# Altium project Modulo Principal.PrjPcb
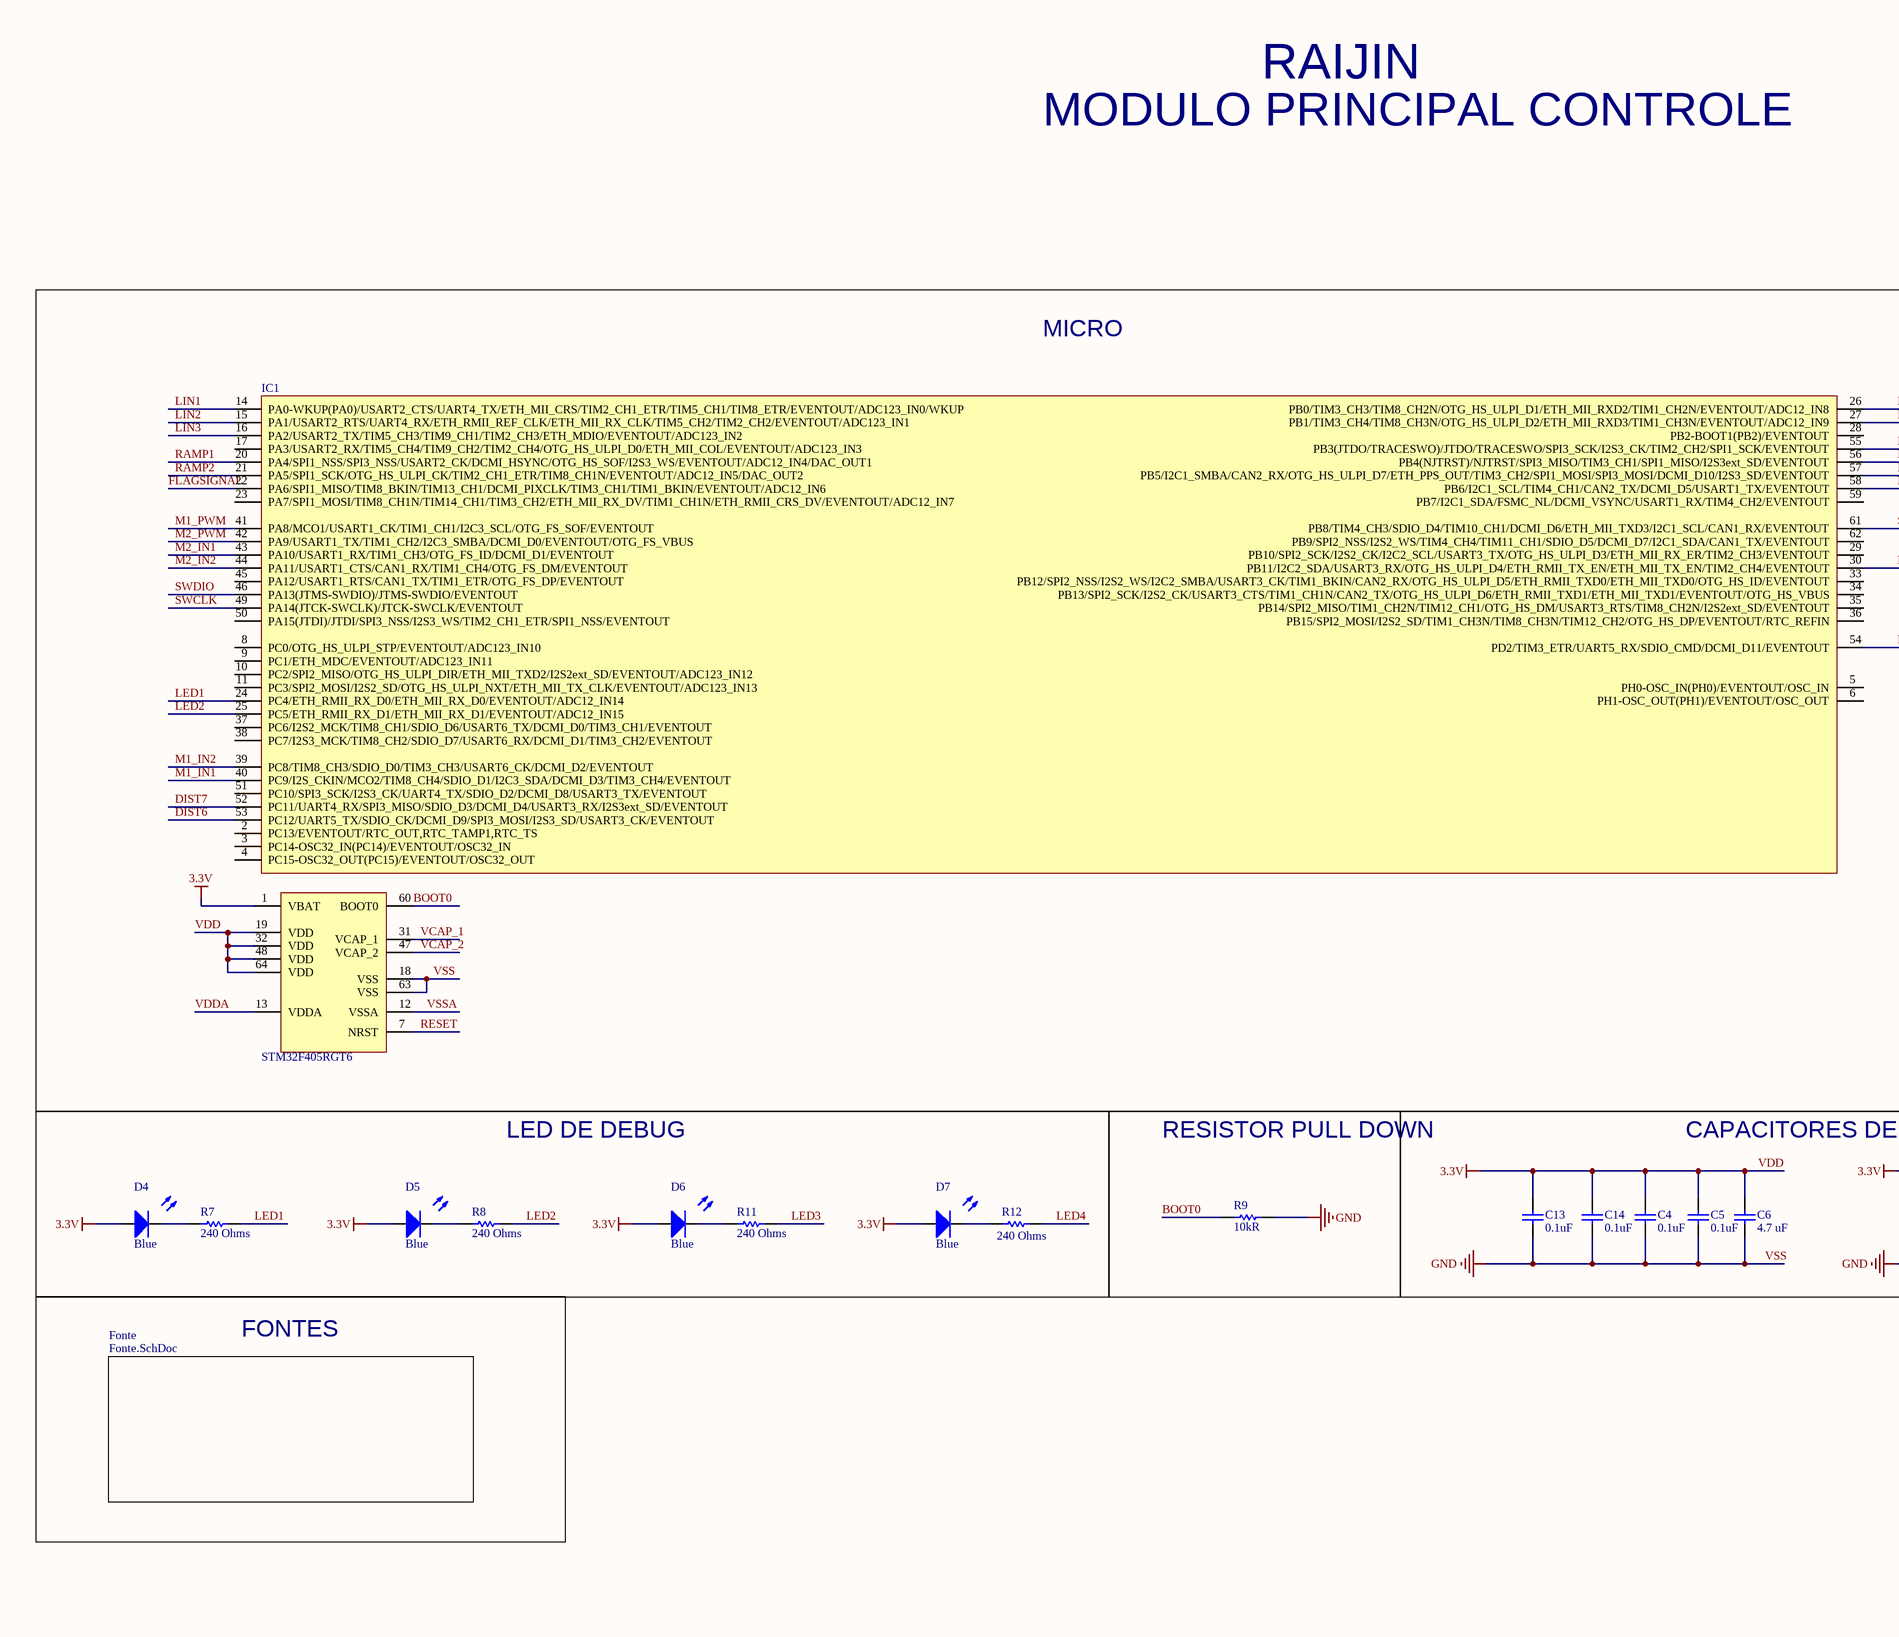
[diagram p0: Controle.SchDoc, left]
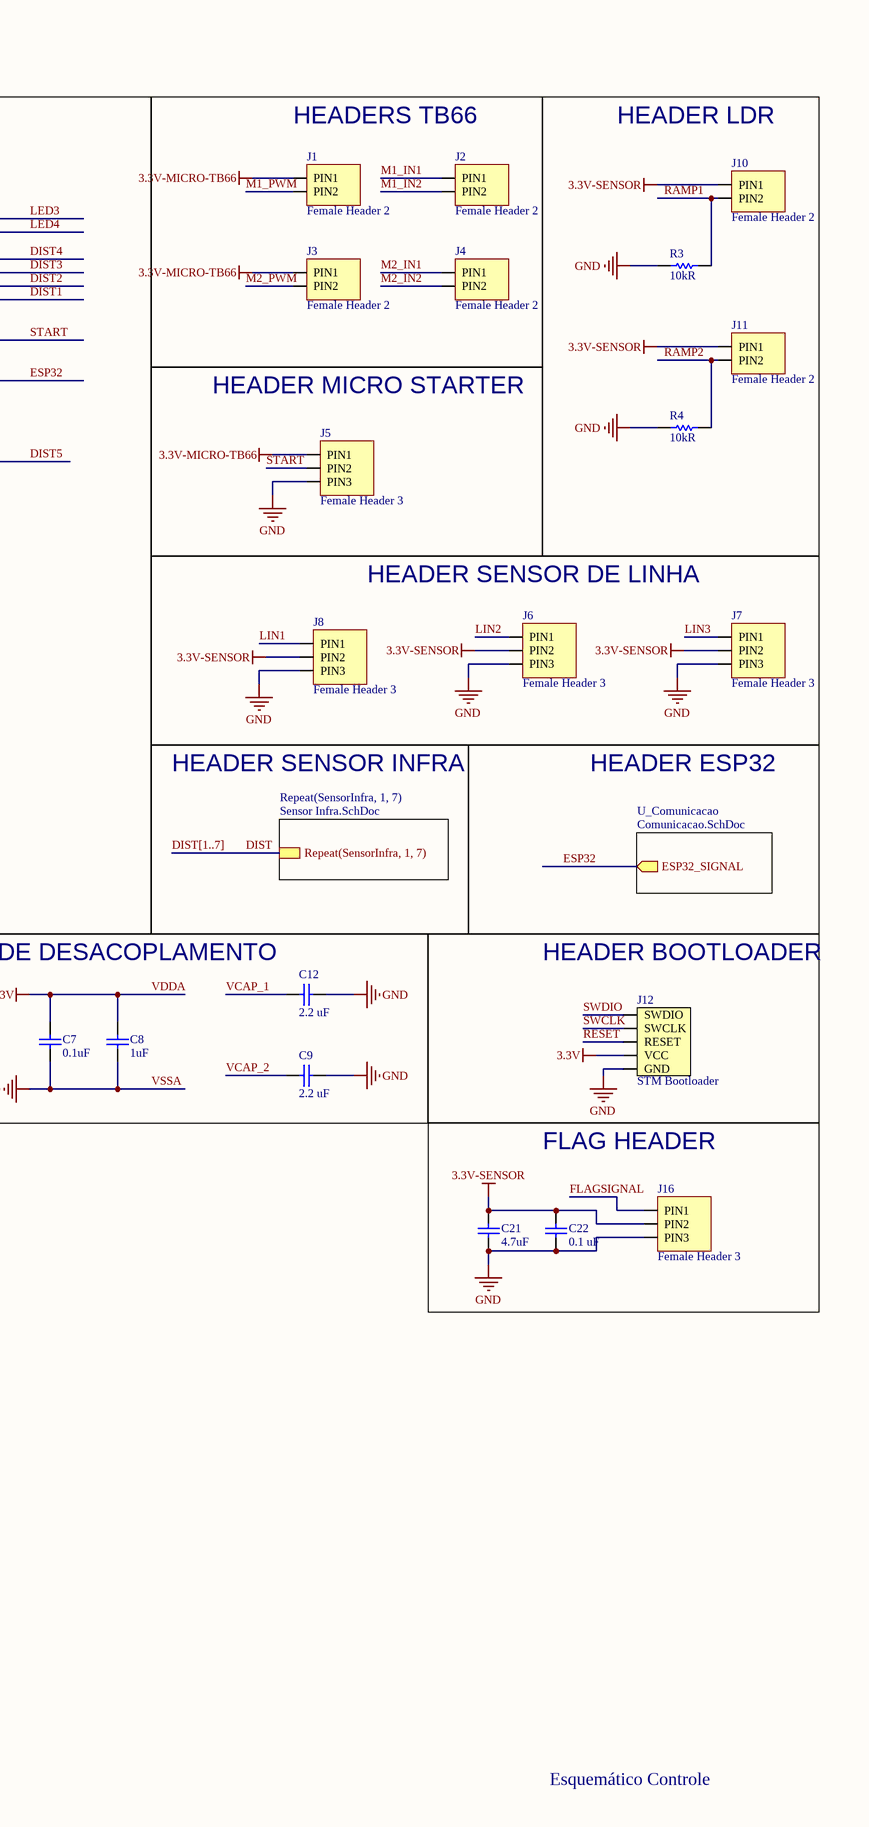
[diagram p1: Controle.SchDoc, right]
4 sheets, 93 parts. Net scope: hierarchical (ports join the sheet entries above them; power ports are global).
Board file: modulo_principal_footprint.PcbDoc
Sheets:
  Controle.SchDoc
    SensorInfra1 = Sensor Infra.SchDoc
    SensorInfra2 = Sensor Infra.SchDoc
    SensorInfra3 = Sensor Infra.SchDoc
    SensorInfra4 = Sensor Infra.SchDoc
    SensorInfra5 = Sensor Infra.SchDoc
    SensorInfra6 = Sensor Infra.SchDoc
    SensorInfra7 = Sensor Infra.SchDoc
    U_Comunicacao = Comunicacao.SchDoc
    Fonte = Fonte.SchDoc

## Sheet Controle.SchDoc
size A2; SheetNumber: 1; SheetTotal: 4

### Parts
C4  0.1uF  [CAPC1005X55N]
C5  0.1uF  [CAPC1005X55N]
C6  4.7 uF  [C0603]
C7  0.1uF  [CAPC1005X55N]
C8  1uF  [C0805]
C9  2.2 uF  [C0402]
C12  2.2 uF  [C0402]
C13  0.1uF  [CAPC1005X55N]
C14  0.1uF  [CAPC1005X55N]
C21  4.7uF  [C0603]
C22  0.1 uF  [C0603]
D4  Blue  [DIODO_2-SMD-3215]
D5  Blue  [DIODO_2-SMD-3215]
D6  Blue  [DIODO_2-SMD-3215]
D7  Blue  [DIODO_2-SMD-3215]
IC1  STM32F405RGT6  [LQFP-64]
J1  Female Header 2  [Female Header 2]
J2  Female Header 2  [Female Header 2]
J3  Female Header 2  [Female Header 2]
J4  Female Header 2  [Female Header 2]
J5  Female Header 3  [FEMALE HEADER 3]
J6  Female Header 3  [FEMALE HEADER 3]
J7  Female Header 3  [FEMALE HEADER 3]
J8  Female Header 3  [FEMALE HEADER 3]
J10  Female Header 2  [Female Header 2]
J11  Female Header 2  [Female Header 2]
J12  STM Bootloader  [STM BOOTLOADER]
J16  Female Header 3  [FEMALE HEADER 3]
R3  10kR  [RESISTOR_0402]
R4  10kR  [RESISTOR_0402]
R7  240 Ohms  [RESC1608X55N]
R8  240 Ohms  [RESC1608X55N]
R9  10kR  [RESISTOR_0402]
R11  240 Ohms  [RESC1608X55N]
R12  240 Ohms  [RESC1608X55N]

### Blocks framed on the sheet
MICRO: IC1
HEADERS TB66: J1-J4
HEADER LDR: J10 J11 R3 R4
HEADER MICRO STARTER: J5
HEADER SENSOR DE LINHA: J6-J8
LED DE DEBUG: D4-D7 R7 R8 R11 R12
RESISTOR PULL DOWN: R9
CAPACITORES DE DESACOPLAMENTO: C4-C9 C12-C14
HEADER BOOTLOADER: J12
FLAG HEADER: C21 C22 J16

### Sub-sheets
Fonte = Fonte.SchDoc: no entries
Repeat(SensorInfra, 1, 7) = Sensor Infra.SchDoc: Repeat(SensorInfra, 1, 7)
U_Comunicacao = Comunicacao.SchDoc: ESP32_SIGNAL (out)

### Nets
3.3V-MICRO-TB66: J1.PIN1 J3.PIN1 J5.PIN1
3.3V-SENSOR: C21.2 C22.2 J6.PIN2 J7.PIN2 J8.PIN2 J10.PIN1 J11.PIN1 J16.PIN2
VDD: C4.2 C5.2 C6.2 C7.2 C8.2 C13.2 C14.2 D4.A D5.A D6.A D7.A IC1.1(VBAT) IC1.13(VDDA) IC1.19(VDD) IC1.32(VDD) IC1.48(VDD) IC1.64(VDD) J12.VCC  [also labelled 3.3V, VDDA]
VSS: C4.1 C5.1 C6.1 C7.1 C8.1 C9.1 C12.1 C13.1 C14.1 C21.1 C22.1 IC1.12(VSSA) IC1.18(VSS) IC1.63(VSS) J5.PIN3 J6.PIN3 J7.PIN3 J8.PIN3 J12.GND J16.PIN3 R3.1 R4.1 R9.2  [also labelled GND, VSSA]
BOOT0: IC1.60(BOOT0) R9.1
DIST: sheet Repeat(SensorInfra, 1, 7)/Repeat(SensorInfra, 1, 7)
DIST1: IC1.58(PB6/I2C1_SCL/TIM4_CH1/CAN2_TX/DCMI_D5/USART1_TX/EVENTOUT)
DIST2: IC1.57(PB5/I2C1_SMBA/CAN2_RX/OTG_HS_ULPI_D7/ETH_PPS_OUT/TIM3_CH2/SPI1_MOSI/SPI3_MOSI/DCMI_D10/I2S3_SD/EVENTOUT)
DIST3: IC1.56(PB4(NJTRST)/NJTRST/SPI3_MISO/TIM3_CH1/SPI1_MISO/I2S3ext_SD/EVENTOUT)
DIST4: IC1.55(PB3(JTDO/TRACESWO)/JTDO/TRACESWO/SPI3_SCK/I2S3_CK/TIM2_CH2/SPI1_SCK/EVENTOUT)
DIST5: IC1.54(PD2/TIM3_ETR/UART5_RX/SDIO_CMD/DCMI_D11/EVENTOUT)
DIST6: IC1.53(PC12/UART5_TX/SDIO_CK/DCMI_D9/SPI3_MOSI/I2S3_SD/USART3_CK/EVENTOUT)
DIST7: IC1.52(PC11/UART4_RX/SPI3_MISO/SDIO_D3/DCMI_D4/USART3_RX/I2S3ext_SD/EVENTOUT)
ESP32: IC1.30(PB11/I2C2_SDA/USART3_RX/OTG_HS_ULPI_D4/ETH_RMII_TX_EN/ETH_MII_TX_EN/TIM2_CH4/EVENTOUT) ; sheet U_Comunicacao/ESP32_SIGNAL
FLAGSIGNAL: IC1.22(PA6/SPI1_MISO/TIM8_BKIN/TIM13_CH1/DCMI_PIXCLK/TIM3_CH1/TIM1_BKIN/EVENTOUT/ADC12_IN6) J16.PIN1
LED1: IC1.24(PC4/ETH_RMII_RX_D0/ETH_MII_RX_D0/EVENTOUT/ADC12_IN14) R7.2
LED2: IC1.25(PC5/ETH_RMII_RX_D1/ETH_MII_RX_D1/EVENTOUT/ADC12_IN15) R8.2
LED3: IC1.26(PB0/TIM3_CH3/TIM8_CH2N/OTG_HS_ULPI_D1/ETH_MII_RXD2/TIM1_CH2N/EVENTOUT/ADC12_IN8) R11.2
LED4: IC1.27(PB1/TIM3_CH4/TIM8_CH3N/OTG_HS_ULPI_D2/ETH_MII_RXD3/TIM1_CH3N/EVENTOUT/ADC12_IN9) R12.2
LIN1: IC1.14(PA0-WKUP(PA0)/USART2_CTS/UART4_TX/ETH_MII_CRS/TIM2_CH1_ETR/TIM5_CH1/TIM8_ETR/EVENTOUT/ADC123_IN0/WKUP) J8.PIN1
LIN2: IC1.15(PA1/USART2_RTS/UART4_RX/ETH_RMII_REF_CLK/ETH_MII_RX_CLK/TIM5_CH2/TIM2_CH2/EVENTOUT/ADC123_IN1) J6.PIN1
LIN3: IC1.16(PA2/USART2_TX/TIM5_CH3/TIM9_CH1/TIM2_CH3/ETH_MDIO/EVENTOUT/ADC123_IN2) J7.PIN1
M1_IN1: IC1.40(PC9/I2S_CKIN/MCO2/TIM8_CH4/SDIO_D1/I2C3_SDA/DCMI_D3/TIM3_CH4/EVENTOUT) J2.PIN1
M1_IN2: IC1.39(PC8/TIM8_CH3/SDIO_D0/TIM3_CH3/USART6_CK/DCMI_D2/EVENTOUT) J2.PIN2
M1_PWM: IC1.41(PA8/MCO1/USART1_CK/TIM1_CH1/I2C3_SCL/OTG_FS_SOF/EVENTOUT) J1.PIN2
M2_IN1: IC1.43(PA10/USART1_RX/TIM1_CH3/OTG_FS_ID/DCMI_D1/EVENTOUT) J4.PIN1
M2_IN2: IC1.44(PA11/USART1_CTS/CAN1_RX/TIM1_CH4/OTG_FS_DM/EVENTOUT) J4.PIN2
M2_PWM: IC1.42(PA9/USART1_TX/TIM1_CH2/I2C3_SMBA/DCMI_D0/EVENTOUT/OTG_FS_VBUS) J3.PIN2
RAMP1: IC1.20(PA4/SPI1_NSS/SPI3_NSS/USART2_CK/DCMI_HSYNC/OTG_HS_SOF/I2S3_WS/EVENTOUT/ADC12_IN4/DAC_OUT1) J10.PIN2 R3.2
RAMP2: IC1.21(PA5/SPI1_SCK/OTG_HS_ULPI_CK/TIM2_CH1_ETR/TIM8_CH1N/EVENTOUT/ADC12_IN5/DAC_OUT2) J11.PIN2 R4.2
RESET: IC1.7(NRST) J12.RESET
START: IC1.61(PB8/TIM4_CH3/SDIO_D4/TIM10_CH1/DCMI_D6/ETH_MII_TXD3/I2C1_SCL/CAN1_RX/EVENTOUT) J5.PIN2
SWCLK: IC1.49(PA14(JTCK-SWCLK)/JTCK-SWCLK/EVENTOUT) J12.CLK(SWCLK)
SWDIO: IC1.46(PA13(JTMS-SWDIO)/JTMS-SWDIO/EVENTOUT) J12.DIO(SWDIO)
VCAP_1: C12.2 IC1.31(VCAP_1)
VCAP_2: C9.2 IC1.47(VCAP_2)
NetD4_C: D4.C R7.1
NetD5_C: D5.C R8.1
NetD6_C: D6.C R11.1
NetD7_C: D7.C R12.1

Not connected (* = marked no-connect by the designer): IC1 2(PC13/EVENTOUT/RTC_OUT,RTC_TAMP1,RTC_TS) 3(PC14-OSC32_IN(PC14)/EVENTOUT/OSC32_IN) 4(PC15-OSC32_OUT(PC15)/EVENTOUT/OSC32_OUT) 5(PH0-OSC_IN(PH0)/EVENTOUT/OSC_IN) 6(PH1-OSC_OUT(PH1)/EVENTOUT/OSC_OUT) 8(PC0/OTG_HS_ULPI_STP/EVENTOUT/ADC123_IN10) 9(PC1/ETH_MDC/EVENTOUT/ADC123_IN11) 10(PC2/SPI2_MISO/OTG_HS_ULPI_DIR/ETH_MII_TXD2/I2S2ext_SD/EVENTOUT/ADC123_IN12) 11(PC3/SPI2_MOSI/I2S2_SD/OTG_HS_ULPI_NXT/ETH_MII_TX_CLK/EVENTOUT/ADC123_IN13) 17(PA3/USART2_RX/TIM5_CH4/TIM9_CH2/TIM2_CH4/OTG_HS_ULPI_D0/ETH_MII_COL/EVENTOUT/ADC123_IN3) 23(PA7/SPI1_MOSI/TIM8_CH1N/TIM14_CH1/TIM3_CH2/ETH_MII_RX_DV/TIM1_CH1N/ETH_RMII_CRS_DV/EVENTOUT/ADC12_IN7) 28(PB2-BOOT1(PB2)/EVENTOUT) 29(PB10/SPI2_SCK/I2S2_CK/I2C2_SCL/USART3_TX/OTG_HS_ULPI_D3/ETH_MII_RX_ER/TIM2_CH3/EVENTOUT) 33(PB12/SPI2_NSS/I2S2_WS/I2C2_SMBA/USART3_CK/TIM1_BKIN/CAN2_RX/OTG_HS_ULPI_D5/ETH_RMII_TXD0/ETH_MII_TXD0/OTG_HS_ID/EVENTOUT) 34(PB13/SPI2_SCK/I2S2_CK/USART3_CTS/TIM1_CH1N/CAN2_TX/OTG_HS_ULPI_D6/ETH_RMII_TXD1/ETH_MII_TXD1/EVENTOUT/OTG_HS_VBUS) 35(PB14/SPI2_MISO/TIM1_CH2N/TIM12_CH1/OTG_HS_DM/USART3_RTS/TIM8_CH2N/I2S2ext_SD/EVENTOUT) 36(PB15/SPI2_MOSI/I2S2_SD/TIM1_CH3N/TIM8_CH3N/TIM12_CH2/OTG_HS_DP/EVENTOUT/RTC_REFIN) 37(PC6/I2S2_MCK/TIM8_CH1/SDIO_D6/USART6_TX/DCMI_D0/TIM3_CH1/EVENTOUT) 38(PC7/I2S3_MCK/TIM8_CH2/SDIO_D7/USART6_RX/DCMI_D1/TIM3_CH2/EVENTOUT) 45(PA12/USART1_RTS/CAN1_TX/TIM1_ETR/OTG_FS_DP/EVENTOUT) 50(PA15(JTDI)/JTDI/SPI3_NSS/I2S3_WS/TIM2_CH1_ETR/SPI1_NSS/EVENTOUT) 51(PC10/SPI3_SCK/I2S3_CK/UART4_TX/SDIO_D2/DCMI_D8/USART3_TX/EVENTOUT) 59(PB7/I2C1_SDA/FSMC_NL/DCMI_VSYNC/USART1_RX/TIM4_CH2/EVENTOUT) 62(PB9/SPI2_NSS/I2S2_WS/TIM4_CH4/TIM11_CH1/SDIO_D5/DCMI_D7/I2C1_SDA/CAN1_TX/EVENTOUT)

### Buses and harness runs
bus DIST[1..7]

### Notes on the sheet
- RAIJIN
- MODULO PRINCIPAL CONTROLE
- HEADER SENSOR INFRA
- HEADER ESP32
- FONTES
- Esquemático Controle

### Library data of the parts
C4 C5 C7 C13 C14 = GRM155R61C104KA88D: CAP CER 0.1uF 16V X5R 0402; Manufacturer: Murata; Tolerance: 10%; Library Control - Checked Footprint: Yes; Library Control - Person that Checked Footprint: Guilherme; Supplier 1: Mouser; Part Number: GRM155R61C104KA88D; Category: Ceramic Capacitors; Price: 1 = 0,10, 10=0,024, 100=0,011 (USD); Supplier Part Number 1: 81-GRM155R61C104KA8D; Library Ref: Capacitor; Operating Temperature: -55°C ~ 85°C; Package / Case: 0402 (1005 Metric); Size / Dimension: 1,0 L x 0,5 W x 0,5 H; Value: 0.1uF; Voltage - Rated: 16V; ESR: -; Dieletric: X5R; Library Control - Checked Schematic: Yes; Library Control - Last Update: 24/07/2021 11:05; Library Control - Person that Checked Schematic: Guilherme; Library Control - Person that did the Last Update Footprint: Guilherme; Library Control - Person that did the Last Update Schematic: Guilherme; ComponentLink1Description: Datasheet; ComponentLink1URL: https://br.mouser.com/datasheet/2/281/1/GRM155R61C104KA88_01A-1983743.pdf; ComponentLink2Description: Mouser Link; ComponentLink2URL: https://br.mouser.com/ProductDetail/Murata-Electronics/GRM155R61C104KA88D?qs=%2Fha2pyFadugsr51Fgcs3VGJIvx6dQb2fpcJyrxDKYTBEoW5q5paGTQ%3D%3D
C6 = GRM188R61C475KAAJD: CAP CER 4.7uF 16V X5R 0603; Manufacturer: MURATA ELECTRONICS; Tolerance: 10%; Voltage - Rated: 16 VDC; ESR: 100mΩ; Library Control - Checked Schematic: Guilherme; Library Control - Person that did the Last Update Footprint: Raquel; Library Control - Person that did the Last Update Schematic: Marcos; Supplier 1: Mouser; Part Number: GRM188R61C475KAAJD; Category: Ceramic capacitor; Price: 1=0,39, 10=0,27, 100=0,172, 1000=0,153 (USD); Supplier Part Number 1: 81-GRM188R61C475KAJD; Library Ref: Capacitor; Operating Temperature: -55°C ~ 85ºC; Package / Case: 0603(1608 metric); Size / Dimension: 1.6 mm L x 0.8 mm W x 0.8 mm H; Value: 4.7 uF; Dieletric: X5R; Library Control - Last Update: 27/06/2021 16:02; Library Control - Person that Checked Schematic: Guilherme; ComponentLink1Description: Datasheet; ComponentLink1URL: https://br.mouser.com/datasheet/2/281/murata_03052018_GRM_Series_1-1310166.pdf; ComponentLink2Description: Mouser Link; ComponentLink2URL: https://br.mouser.com/ProductDetail/Murata-Electronics/GRM188R61C475KAAJD?qs=mJtAphxf33T5qOjL9fHG9Q%3D%3D
C8 = CC0805ZRY5V8BB105: CAP CER 1uF 25V Y5V 0805; Manufacturer: Yageo; Tolerance: -20%, +80%; ESR: 0.05; Library Control - Checked Footprint: Yes; Library Control - Person that Checked Footprint: Nikaum; Supplier 1: Mouser; Part Number: CC0805ZRY5V8BB105; Category: Ceramic Capacitor; Price: 1=0.21, 10=0.151, 100=0.071 (USD); Supplier Part Number 1: 603-CC805KRX7R9BB331; Library Ref: Capacitor; Operating Temperature: -30 C ~ 85 C; Package / Case: 0805 (2012 Metric); Size / Dimension: 2,00 L x 1,25 W x 0,85 H; Value: 1uF; Voltage - Rated: 25V; Dieletric: Y5V; Library Control - Checked Schematic: Yes; Library Control - Last Update: 27/06/2021 23:54; Library Control - Person that Checked Schematic: Nikaum; Library Control - Person that did the Last Update Footprint: NIkaum; Library Control - Person that did the Last Update Schematic: Nikaum; ComponentLink1Description: Datasheet; ComponentLink1URL: https://br.mouser.com/datasheet/2/447/yago_s_a0004841839_1-2286631.pdf; ComponentLink2Description: Mouser Link; ComponentLink2URL: https://br.mouser.com/ProductDetail/Yageo/CC0805ZRY5V8BB105?qs=%2Fha2pyFaduhNpscxq1sti%2FWGfef5%252B7abNQFh0pSFqzoFpwPoZWE8UM%252BupYNGXIAb
C9 C12 = C1005X5R1C225M050BC: CAP CER 2.2UF 16V X5R 0402; Manufacturer: TDK; Tolerance: 20%; Voltage - Rated: 16 VDC; Library Control - Checked Footprint: Yes; Library Control - Person that Checked Footprint: Nikaum; Supplier 1: Mouser; Part Number: C1005X5R1C225M050BC; Category: Ceramic Capacitor; Price: 1= 0,35, 10= 0,24, 100= 0,137 (USD); Supplier Part Number 1: 810-C1005X5R1C225M; Library Ref: Capacitor; Operating Temperature: -55 C ~ 85 C; Package / Case: 0402 (1005 Metric); Size / Dimension: 1,00 L x 0,50 W x 0,50 H; Value: 2.2 uF; Dieletric: X5R; Library Control - Checked Schematic: Yes; Library Control - Last Update: 28/06/2021 00:25; Library Control - Person that Checked Schematic: Nikaum; Library Control - Person that did the Last Update Footprint: Nikaum; Library Control - Person that did the Last Update Schematic: Nikaum; ComponentLink1Description: Datasheet; ComponentLink1URL: https://product.tdk.com/system/files/dam/doc/product/capacitor/ceramic/mlcc/catalog/mlcc_commercial_general_en.pdf; ComponentLink2Description: Mouser Link; ComponentLink2URL: https://br.mouser.com/ProductDetail/TDK/C1005X5R1C225M050BC?qs=%2Fha2pyFaduhU5KeTuzJ6cgu5msb4qv%252BHR3wvbG6WdO9o%252B44FZFkWvfar1ahjHCOq; ComponentLink3Description: ESR; ComponentLink3URL: https://product.tdk.com/en/search/capacitor/ceramic/mlcc/info?part_no=C1005X5R1C225M050BC
C21 = CC0603KRX5R8BB475: CAP CER 4.7uF 25V X5R 0603; Manufacturer: Yageo; Tolerance: 10%; ESR: 0.05; Library Control - Checked Footprint: Yes; Library Control - Person that Checked Footprint: Nikaum; Supplier 1: Mouser; Part Number: CC0603KRX5R8BB475; Category: Ceramic Capacitor; Price: 1=0.25, 10=0.164, 100=0,093 (USD); Supplier Part Number 1: 603-CC0603KRX58BB475; Library Ref: Capacitor; Operating Temperature: -55 C ~ 125 C; Package / Case: 0603 (1608 Metric); Size / Dimension: 1,60 L x 0,80 W x 0,87 H; Value: 4.7uF; Voltage - Rated: 25V; Dieletric: X5R; Library Control - Checked Schematic: Yes; Library Control - Last Update: 27/06/2021 23:47; Library Control - Person that Checked Schematic: Nikaum; Library Control - Person that did the Last Update Footprint: Nikaum; Library Control - Person that did the Last Update Schematic: Nikaum; ComponentLink1Description: Datasheet; ComponentLink1URL: https://br.mouser.com/datasheet/2/447/yago_s_a0011397150_1-2286655.pdf; ComponentLink2Description: Mouser Link; ComponentLink2URL: https://br.mouser.com/ProductDetail/Yageo/CC0603KRX5R8BB475?qs=%2Fha2pyFaduh%2F7Q8z%252B7Ot0eflSx5gYDgPHryPFxzpgCUeMwc25ZtPlNgXae48%252BTjy
C22 = C0603C104M5RACTU: CAP CER 0.1uF 50V X7R 0603; Manufacturer: Kemet; Tolerance: 20%; Voltage - Rated: 50 VDC; Library Control - Checked Footprint: Yes; Library Control - Person that Checked Footprint: Stéfany (Ster); Supplier 1: Mouser; Part Number: C0603C104M5RACTU; Category: Ceramic Capacitor; Price: 1=0,22 10=0,154 100=0.106 (USD); Supplier Part Number 1: 80-C0603C104M5R; Library Ref: Capacitor; Operating Temperature: -55°C ~ 125°C; Package / Case: 0603(1608 metric); Size / Dimension: 1.6 L x 0.8 W x 0.8 H (USD); Value: 0.1 uF; Dieletric: X7R; Library Control - Checked Schematic: Yes; Library Control - Last Update: 09/09/2021 15:15; Library Control - Person that Checked Schematic: Stéfany (Ster); Library Control - Person that did the Last Update Schematic: Stéfany (Ster); ComponentLink1Description: Datasheet; ComponentLink1URL: https://br.mouser.com/datasheet/2/212/KEM_C1002_X7R_SMD-1102033.pdf; ComponentLink2Description: Mouser Link; ComponentLink2URL: https://br.mouser.com/ProductDetail/KEMET/C0603C104M5RACTU?qs=YkRtRX%252BfoqJT%252B0m410IP4A%3D%3D; ComponentLink3Description: ESR; ComponentLink3URL: https://www.kemet.com/en/us/capacitors/ceramic/product/C0603C104M5RACTU.html
D4-D7 = EAST3215BA5: LED 75mW BLUE 45MCD 3215; Manufacturer: Everlight Electronics; Current - Forward (If): 20 mA; Voltage - Forward (Vf): 3,30 V; Viewing Angle: 130°; Wavelength: 468 nm; Reverse Voltage: 5 V; Library Control - Checked Footprint: yes; Library Control - Person that Checked Footprint: Lucas; Library Control - Person that did the Last Update Footprint: Stéfany (Ster); Supplier 1: Mouser; Part Number: EAST3215BA5; Category: Standard LEDs - SMD; Price: 1 = 0,3800, 10 = 0,2050, 100 = 0.1080 (USD); Package / Case: 3215; Color: Blue; Operating Temperature: - 40 °C ~ 85 °C; Luminous Intensity: 45 mcd; Library Ref: Diodo/Led; Supplier Part Number 1: 638-EAST3215BA5; Max Power Dissipation: 75 mW; Max Current Rating: 20 mA; Library Control - Checked Schematic: yes; Library Control - Last Update: 13/06/2021 12:45; Library Control - Person that Checked Schematic: Lucas; Library Control - Person that did the Last Update Schematic: Stéfany (Ster); ComponentLink1Description: Mouser Link; ComponentLink1URL: https://www.mouser.com/ProductDetail/Everlight/EAST3215BA5?qs=Cqqh%252BS766wnzp9nQVj5A4g==; ComponentLink2Description: Datasheet; ComponentLink2URL: https://www.mouser.com/datasheet/2/143/EAST3215BA5-1154292.pdf
IC1 = STM32F405RGT6: IC MCU 32-BIT 192kB FLASH ARM Cortex-M4 168MHz  LQFP-64; Manufacturer: STM; Number of I/Os: 51; Oscillator Type: Internal; Program Memory Size: 1024kB; Peripherals: CAN, I2C, SDIO, I2S / SPI, UART / USART, USB; Core Processor: ARM Cortex M0+; Voltage - Supply (Vcc/Vdd): 1.8 V to 3.6 V; Number of Timers/Counters: 17; Number of ADC Channels: 16; Library Control - Person that did the Last Update Footprint: Marcos; Supplier 1: Mouser; Part Number: STM32F405RGT6; Category: ARM Microcontrollers - MCU; Price: 1 = 12,95, 10 = 11,91,  100 = 11,42, 500 = 8,95 (USD); Package/Case: LQFP-64; Operating Temperature: -40°C to 85°C; Connectivity: -; Speed: 168MHz; Program Memory Type: Flash; RAM Size: 192k B; Core Size: *; Number of SPI Channels: -; Number of I2C Channels: -; Number of UART/USART Channels: -; Number of Ethernet Channels: -; Series: STM32F405RG; Library Ref: Microcrontrollers; Supplier Part Number 1: 511-STM32F405RGT6; Library Control - Checked Footprint: *; Library Control - Checked Schematic: *; Library Control - Last Project that Used: *; Library Control - Last Update: *; Library Control - Person that Checked Footprint: *; Library Control - Person that Checked Schematic: *; Library Control - Person that did the Last Update Schematic: Marcos; ComponentLink1Description: Mouser Link; ComponentLink1URL: https://www.mouser.com/ProductDetail/STMicroelectronics/STM32G030J6M6?qs=uwxL4vQweFMe%2Fiu4dY6izA%3D%3D; ComponentLink2Description: Datasheet Link; ComponentLink2URL: https://www.mouser.com/datasheet/2/389/dm00613878-1799578.pdf
J1-J4 J10 J11 = Female Header 2: System: Connector
J5-J8 J16 = Female Header 3: Number of Contacts: 3; System: Connector; Library Ref: Header
J12 = Barramento de Gravação STM: BARRAMENTO DE GRAVAÇÃO; Number of Contacts: 5; Library Ref: Header
R3 R4 R9 = RC0402JR-0710KL: RES SMD 10K OHM 5% 1/16W 0402; Manufacturer: Yageo; Temperature Coefficient: 100 PPM / C; Power Rating: 62.5 mW (1/16 W); Voltage Rating: 50 V; Library Control - Checked Footprint: Yes; Library Control - Person that Checked Footprint: Nikaum; Library Control - Person that did the Last Update Footprint: Dalarme; Supplier 1: Mouser; Part Number: RC0402JR-0710KL; Category: Thick Film Resistors - SMD; Price: 1=0,10, 10=0,01, 100=0,004 1000=0,003 (USD); Package / Case: 0402 (1005 Metric); Operating Temperature: -55 C ~ 155 C; Value: 10kR; Tolerance: 5 %; Library Ref: Resistor; Resistor Type: Fixo; Size / Dimension: 1 mm L x  0.5 mm W x  0.35 mm H; Supplier Part Number 1: 603-RC0402JR-0710KL; Library Control - Checked Schematic: Yes; Library Control - Last Update: 27/06/2021 20:59; Library Control - Person that Checked Schematic: Nikaum; Library Control - Person that did the Last Update Schematic: Nikaum; ComponentLink1Description: Mouser Link; ComponentLink1URL: https://br.mouser.com/ProductDetail/Yageo/RC0402JR-0710KL?qs=%2Fha2pyFadugksLQP8sr8wSFqaMq1e9zbbX4dfYXawN%252BqoBT8jIbVcw%3D%3D; ComponentLink2Description: Datasheet Link; ComponentLink2URL: https://br.mouser.com/datasheet/2/447/PYu_RC_Group_51_RoHS_L_10-1664068.pdf
R7 R8 R11 R12 = RC0603FR-07240RL: RES SMD 240 OHM 1% 1/10W 0603; Manufacturer: YAGEO; Temperature Coefficient: 100 PPM / C; Power Rating: 1/10 W (100 mW); Supplier 1: Mouser; Part Number: RC0603FR-07240RL; Category: Current Sense Resistors - SMD; Price: 1= 0,10, 10= 0,024, 100= 0,01 (USD); Package / Case: 0603 (1608 metric); Operating Temperature: -55C ~ +155C; Value: 240 Ohms; Tolerance: 1%; Voltage Rating: -; Library Ref: Resistor; Resistor Type: Fixed; Size / Dimension: 1.6mm L x 0.8mm W x 0.45mm H; Supplier Part Number 1: 603-RC0603FR-07240RL; ComponentLink1Description: Mouser Link; ComponentLink1URL: https://br.mouser.com/ProductDetail/YAGEO/RC0603FR-07240RL?qs=%2Fha2pyFaduiUxY9aBc7vYsXmDGghjtsAaASQnplf3Fe6IIYOTbEeqCNZ6k5LKUyr; ComponentLink2Description: Datasheet; ComponentLink2URL: https://br.mouser.com/datasheet/2/447/Yageo_03_18_2021_PYu_RC_Group_51_RoHS_L_11-2199992.pdf

## Sheet Sensor Infra.SchDoc
size A4; SheetNumber: 3; SheetTotal: 4
Used 7 times, as channels SensorInfra1, SensorInfra2, SensorInfra3, SensorInfra4, SensorInfra5, SensorInfra6, SensorInfra7. Parts and nets are listed once, with the designators drawn on the sheet.
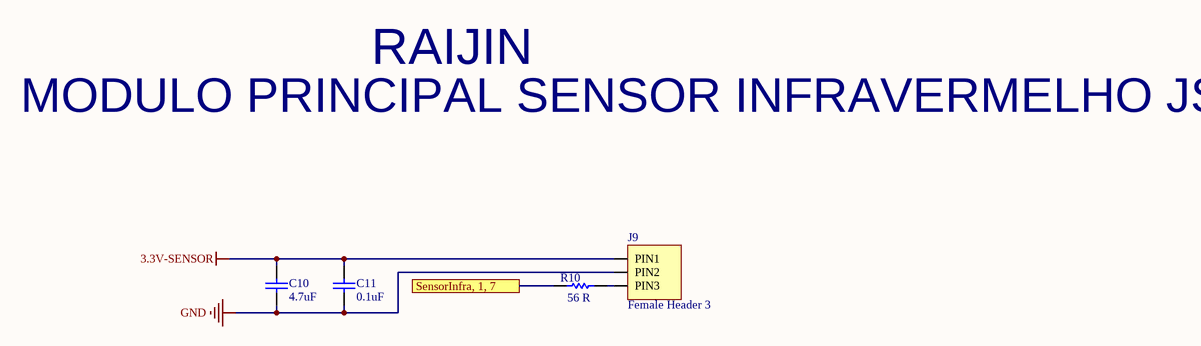
[diagram p2: Sensor Infra.SchDoc]

### Parts
C10  4.7uF  [C0805]
C11  0.1uF  [C0805]
J9  Female Header 3  [FEMALE HEADER 3]
R10  56 R  [RESISTOR_0603]

### Ports
SensorInfra, 1, 7

### Nets
3.3V-SENSOR: C10.2 C11.2 J9.PIN1
GND: C10.1 C11.1 J9.PIN2
SensorInfra, 1, 7: R10.1 ; port SensorInfra, 1, 7
NetJ9_PIN3: J9.PIN3 R10.2

### Channels
SensorInfra1: designators end in _SensorInfra1; ports SensorInfra, 1, 7=NetR10_SensorInfra1_1
SensorInfra2: designators end in _SensorInfra2; ports SensorInfra, 1, 7=NetR10_SensorInfra2_1
SensorInfra3: designators end in _SensorInfra3; ports SensorInfra, 1, 7=NetR10_SensorInfra3_1
SensorInfra4: designators end in _SensorInfra4; ports SensorInfra, 1, 7=NetR10_SensorInfra4_1
SensorInfra5: designators end in _SensorInfra5; ports SensorInfra, 1, 7=NetR10_SensorInfra5_1
SensorInfra6: designators end in _SensorInfra6; ports SensorInfra, 1, 7=NetR10_SensorInfra6_1
SensorInfra7: designators end in _SensorInfra7; ports SensorInfra, 1, 7=NetR10_SensorInfra7_1

### Notes on the sheet
- RAIJIN
- MODULO PRINCIPAL SENSOR INFRAVERMELHO JS40F

### Library data of the parts
C10 = 0805X475M250CT: CAP CER 4.7uF 25V 20% 0805; Manufacturer: Walsin; Dieletric: X5R; Library Control - Checked Footprint: No; Library Control - Checked Schematic: Yes; Library Control - Person that Checked Schematic: Guilherme; Library Control - Person that did the Last Update Schematic: Marcos; Supplier 1: Mouser; Part Number: 0805X475M250CT; Category: Ceramic Capacitor; Price: 1=0,26 10=0,178 100=0,101 1000=0,064 (USD); Supplier Part Number 1: 791-0805X475M250CT; Library Ref: Capacitor; Operating Temperature: -55°C ~ 85°C; Package / Case: 0805(2012 metric); Size / Dimension: 2 mm L x 1.25 mm W x 0.8 mm H; Tolerance: 20%; Value: 4.7uF; Voltage - Rated: 25V; ESR: -; Library Control - Last Update: 26/06/2021 19:59; ComponentLink1Description: Datasheet; ComponentLink1URL: https://br.mouser.com/datasheet/2/210/WTC_MLCC_General_Purpose-1534899.pdf; ComponentLink2Description: Mouser Link; ComponentLink2URL: https://br.mouser.com/ProductDetail/Walsin/0805X475M250CT?qs=%2Fha2pyFadugovbtJ4IPO2aI5%2FHfN6czWOLxzJ368rfolfgZFQZPK8JJR9MicoCMy
C11 = 08053C104KAT2A: CAP CER 0.1uF 25V X7R 0805; Manufacturer: AVX; Tolerance: 10%; ESR: 0.05; Library Control - Checked Footprint: Yes; Library Control - Person that Checked Footprint: Nikaum; Supplier 1: Mouser; Part Number: 08053C104KAT2A; Category: Ceramic Capacitor; Price: 1=0,14, 10=0,069, 100=0,038 (USD); Supplier Part Number 1: 581-08053C104K; Library Ref: Capacitor; Operating Temperature: -55 C ~ 125 C; Package / Case: 0805 (2012 metric); Size / Dimension: 2,00 L x 1,20 W x 0,50 H; Value: 0.1uF; Voltage - Rated: 25V; Dieletric: X7R; Library Control - Checked Schematic: Yes; Library Control - Last Update: 27/06/2021 23:35; Library Control - Person that Checked Schematic: Nikaum; Library Control - Person that did the Last Update Footprint: Nikaum; Library Control - Person that did the Last Update Schematic: Nikaum; ComponentLink1Description: Datasheet; ComponentLink1URL: https://br.mouser.com/datasheet/2/40/X7RDielectric-777024.pdf; ComponentLink2Description: Mouser Link; ComponentLink2URL: https://br.mouser.com/ProductDetail/AVX/08053C104KAT2A?qs=EihRZLdKnF2GcTBzDkE%2FiQ%3D%3D
J9 = Female Header 3: Number of Contacts: 3; System: Connector; Library Ref: Header
R10 = CR0603-FX-56R0ELF: RES SMD 56 OHMS 1% 1/10W 0603; Manufacturer: Bourns; Temperature Coefficient: 100 PPM / C; Power Rating: 100 mW (1/10 W); Voltage Rating: 50 V; Library Control - Checked Footprint: Yes; Library Control - Person that Checked Footprint: Nikaum; Library Control - Person that did the Last Update Footprint: Nicolas; Supplier 1: Mouser; Part Number: CR0603-FX-56R0ELF; Category: Thick Film Resistors - SMD; Price: 1=0,10, 10=0,019, 100=0,011(USD); Package / Case: 0603 (1608 Metric); Operating Temperature: - 55°C ~ 155°C; Value: 56 R; Tolerance: 1 %; Library Ref: Resistor; Resistor Type: Fixo; Size / Dimension: 1,60 L x 0,80 W x 0,45 H; Supplier Part Number 1: 652-CR0603FX-56R0ELF; Library Control - Checked Schematic: Yes; Library Control - Last Update: 27/06/2021 20:52; Library Control - Person that Checked Schematic: Nikaum; Library Control - Person that did the Last Update Schematic: Nikaum; ComponentLink1Description: Mouser Link; ComponentLink1URL: https://br.mouser.com/ProductDetail/Bourns/CR0603-FX-56R0ELF?qs=0nF2VnfAjXkVwSNglvrNkw%3D%3D; ComponentLink2Description: Datasheet; ComponentLink2URL: https://br.mouser.com/datasheet/2/54/crxxxxx-1858361.pdf

## Sheet Comunicacao.SchDoc
size A4; SheetNumber: 4; SheetTotal: 4
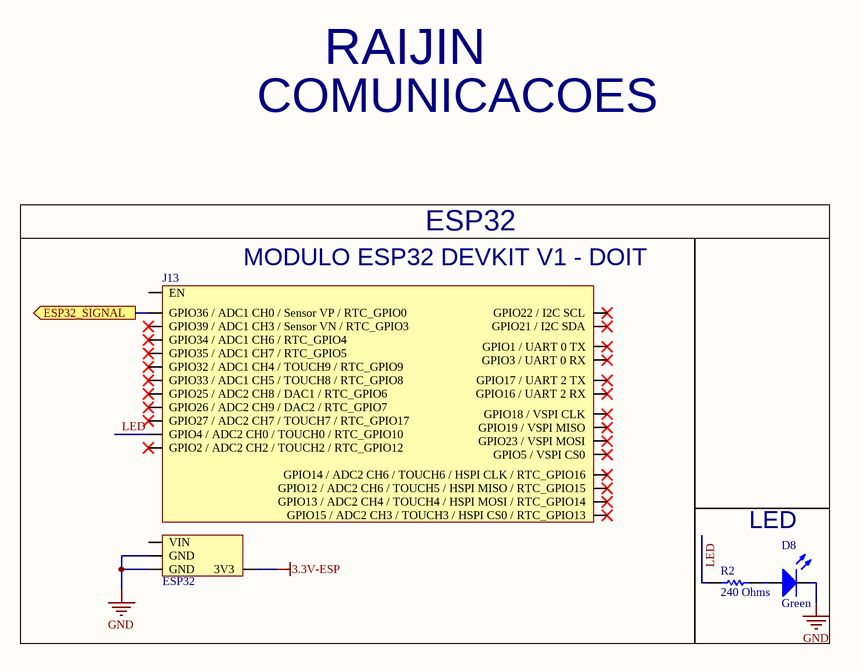
[diagram p3: Comunicacao.SchDoc]

### Parts
D8  Green  [LED_0603]
J13  ESP32  [Modulo ESP32]
R2  240 Ohms  [RESC1608X55N]

### Blocks framed on the sheet
ESP32: J13
LED: D8 R2

### Ports
ESP32_SIGNAL (out)

### Nets
3.3V-ESP: J13.3V3
GND: D8.C J13.GND  [project net VSS]
ESP32: J13.PIN2(GPIO36_/_ADC1_CH0_/_Sensor_VP_/_RTC_GPIO0) ; port ESP32_SIGNAL
LED: J13.PIN26(GPIO4_/_ADC2_CH0_/_TOUCH0_/_RTC_GPIO10) R2.1
NetD8_A: D8.A R2.2

Not connected (* = marked no-connect by the designer): J13 EN PIN3(GPIO39_/_ADC1_CH3_/_Sensor_VN_/_RTC_GPIO3)* PIN4(GPIO34_/_ADC1_CH6_/_RTC_GPIO4)* PIN5(GPIO35_/_ADC1_CH7_/_RTC_GPIO5)* PIN6(GPIO32_/_ADC1_CH4_/_TOUCH9_/_RTC_GPIO9)* PIN7(GPIO33_/_ADC1_CH5_/_TOUCH8_/_RTC_GPIO8)* PIN8(GPIO25_/_ADC2_CH8_/_DAC1_/_RTC_GPIO6)* PIN9(GPIO26_/_ADC2_CH9_/_DAC2_/_RTC_GPIO7)* PIN10(GPIO27_/_ADC2_CH7_/_TOUCH7_/_RTC_GPIO17)* PIN11(GPIO14_/_ADC2_CH6_/_TOUCH6_/_HSPI_CLK_/_RTC_GPIO16)* PIN12(GPIO12_/_ADC2_CH6_/_TOUCH5_/_HSPI_MISO_/_RTC_GPIO15)* PIN13(GPIO13_/_ADC2_CH4_/_TOUCH4_/_HSPI_MOSI_/_RTC_GPIO14)* PIN16(GPIO23_/_VSPI_MOSI)* PIN17(GPIO22_/_I2C_SCL)* PIN18(GPIO1_/_UART_0_TX)* PIN19(GPIO3_/_UART_0_RX)* PIN20(GPIO21_/_I2C_SDA)* PIN21(GPIO19_/_VSPI_MISO)* PIN22(GPIO18_/_VSPI_CLK)* PIN23(GPIO5_/_VSPI_CS0)* PIN24(GPIO17_/_UART_2_TX)* PIN25(GPIO16_/_UART_2_RX)* PIN27(GPIO2_/_ADC2_CH2_/_TOUCH2_/_RTC_GPIO12)* PIN28(GPIO15_/_ADC2_CH3_/_TOUCH3_/_HSPI_CS0_/_RTC_GPIO13)* VIN

### Notes on the sheet
- RAIJIN
- COMUNICACOES
- (near J13) MODULO ESP32 DEVKIT V1 - DOIT

### Library data of the parts
D8 = 150060VS75000: LED 0.072W GREEN 40MCD 0603; Manufacturer: Wurth Elektronik; Current - Forward (If): 20 mA; Voltage - Forward (Vf): 2 V; Viewing Angle: 140°; Wavelength: 570nm; Max Power Dissipation: 72mW; Max Current Rating: 100mA; Reverse Voltage:: 5V; Library Control - Last Project that Used: Diodo/Led; Library Control - Person that Checked Footprint: Nícolas; Library Control - Person that did the Last Update Footprint: Marcos; Supplier 1: Mouser; Manufacturer Part Number: 150060VS75000; Category: Standard LEDs - SMD; Price: 1 = 0.15, 50 = 0.138, 100 = 0.118 (USD); Package / Case: 0603; Color: Green; Operating Temperature: -40~85 °C; Luminous Intensity: 40 mcd; Library Ref: LED; Supplier Part Number 1: 710-150060VS75000; Library Control - Checked Footprint: 25/07/2021; Library Control - Checked Schematic: 25/07/2021; Library Control - Last Update: 06/08/2021; Library Control - Person that Checked Schematic: Nícolas; Library Control - Person that did the Last Update Schematic: Marcos; ComponentLink1Description: Mouser Link; ComponentLink1URL: https://br.mouser.com/ProductDetail/Wurth-Elektronik/150060VS75000?qs=%2Fha2pyFaduhuT%2FKGSijZP0vTyJZ9U993KfsBQSxqATYhY9jnc2c09tXoMoJ3wn4L; ComponentLink2Description: Datasheet Link; ComponentLink2URL: https://br.mouser.com/datasheet/2/445/150060VS75000-1714627.pdf
J13 = Modulo ESP32: Header Modulo ESP32; Number of Contacts: 15; Library Control - Checked Footprint: Nikaum; Library Ref: Header; Library Control - Checked Schematic: Nikaum; Library Control - Last Project that Used: *; Library Control - Last Update: *; Library Control - Person that Checked Footprint: *; Library Control - Person that Checked Schematic: *; Library Control - Person that did the Last Update Schematic: Nikaum; Library Control - Persont that did the Last Update Footprint: Nikaum
R2 = RC0603FR-07240RL: as R7 on sheet Controle; Supplier 1: Mouser; Part Number: RC0603FR-07240RL; Category: Current Sense Resistors - SMD; Price: 1= 0,10, 10= 0,024, 100= 0,01 (USD); Package / Case: 0603 (1608 metric); Operating Temperature: -55C ~ +155C; Value: 240 Ohms; Tolerance: 1%; Voltage Rating: -; Library Ref: Resistor; Resistor Type: Fixed; Size / Dimension: 1.6mm L x 0.8mm W x 0.45mm H; Supplier Part Number 1: 603-RC0603FR-07240RL; ComponentLink1Description: Mouser Link; ComponentLink1URL: https://br.mouser.com/ProductDetail/YAGEO/RC0603FR-07240RL?qs=%2Fha2pyFaduiUxY9aBc7vYsXmDGghjtsAaASQnplf3Fe6IIYOTbEeqCNZ6k5LKUyr; ComponentLink2Description: Datasheet; ComponentLink2URL: https://br.mouser.com/datasheet/2/447/Yageo_03_18_2021_PYu_RC_Group_51_RoHS_L_11-2199992.pdf

## Sheet Fonte.SchDoc
size A4; SheetNumber: 2; SheetTotal: 4
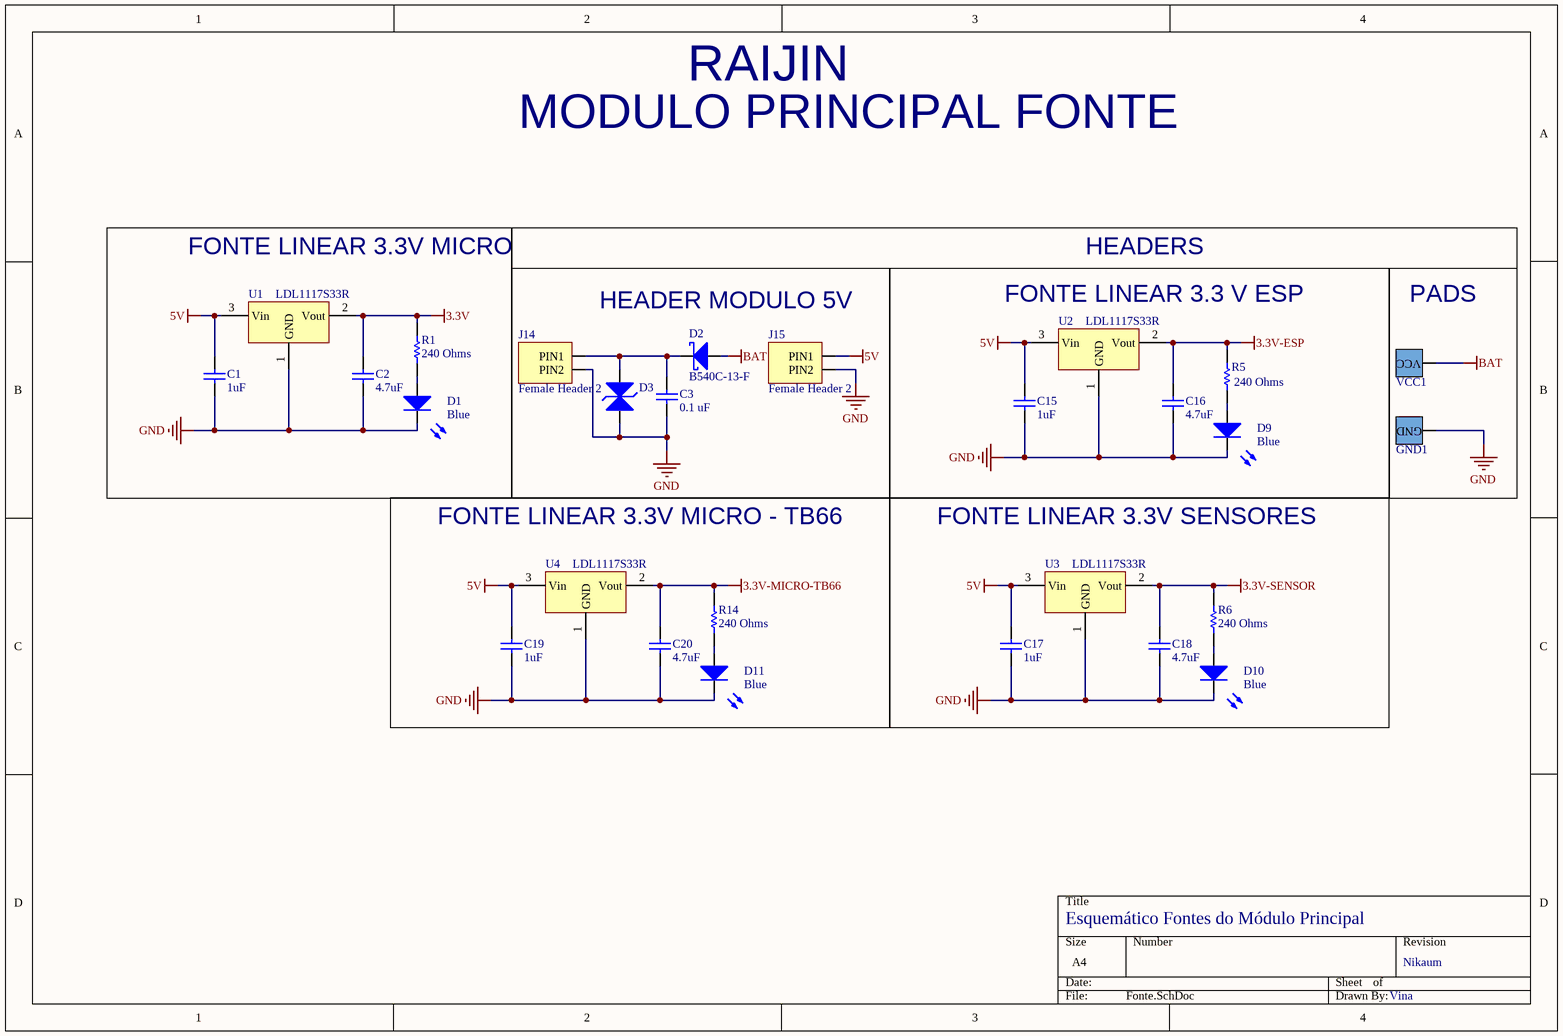
[diagram p4: Fonte.SchDoc]

### Parts
C1  1uF  [C0805]
C2  4.7uF  [C0805]
C3  0.1 uF  [C0805]
C15  1uF  [C0805]
C16  4.7uF  [C0805]
C17  1uF  [C0805]
C18  4.7uF  [C0805]
C19  1uF  [C0805]
C20  4.7uF  [C0805]
D1  Blue  [DIODO_2-SMD-3215]
D2  B540C-13-F  [DIODO_DO-214AB]
D3  ESD110B102ELE6327XTMA1  [DIODO-TSSLP-2-4]  (value not drawn)
D9  Blue  [DIODO_2-SMD-3215]
D10  Blue  [DIODO_2-SMD-3215]
D11  Blue  [DIODO_2-SMD-3215]
GND1  Ground Pad  [PAD_ALIMENTAÇÃO_MINI]  (value not drawn)
J14  Female Header 2  [Female Header 2]
J15  Female Header 2  [Female Header 2]
R1  240 Ohms  [RESC1608X55N]
R5  240 Ohms  [RESC1608X55N]
R6  240 Ohms  [RESC1608X55N]
R14  240 Ohms  [RESC1608X55N]
U1  LDL1117S33R  [SOT-223-4]
U2  LDL1117S33R  [SOT-223-4]
U3  LDL1117S33R  [SOT-223-4]
U4  LDL1117S33R  [SOT-223-4]
VCC1  Source Pad  [PAD_ALIMENTAÇÃO_MINI]  (value not drawn)

### Blocks framed on the sheet
FONTE LINEAR 3.3V MICRO: C1 C2 D1 R1 U1
HEADER MODULO 5V: C3 D2 D3 J14 J15
PADS: GND1 VCC1
FONTE LINEAR 3.3V MICRO - TB66: C19 C20 D11 R14 U4
FONTE LINEAR 3.3V SENSORES: C17 C18 D10 R6 U3

### Nets
3.3V: C2.2 R1.2 U1.2(Vout)  [project net VDD]
3.3V-ESP: C16.2 R5.2 U2.2(Vout)
3.3V-MICRO-TB66: C20.2 R14.2 U4.2(Vout)
3.3V-SENSOR: C18.2 R6.2 U3.2(Vout)
5V: C1.2 C15.2 C17.2 C19.2 J15.PIN1 U1.3(Vin) U2.3(Vin) U3.3(Vin) U4.3(Vin)
BAT: D2.A VCC1.A(VCC)
GND: C1.1 C2.1 C3.2 C15.1 C16.1 C17.1 C18.1 C19.1 C20.1 D1.C D3.A D9.C D10.C D11.C GND1.A(GND) J14.PIN2 J15.PIN2 U1.1(GND) U2.1(GND) U3.1(GND) U4.1(GND)  [project net VSS]
NetC3_1: C3.1 D2.C D3.C J14.PIN1
NetD1_A: D1.A R1.1
NetD9_A: D9.A R5.1
NetD10_A: D10.A R6.1
NetD11_A: D11.A R14.1

### Notes on the sheet
- RAIJIN
- MODULO PRINCIPAL FONTE
- FONTE LINEAR 3.3 V ESP
- HEADERS
- Esquemático Fontes do Módulo Principal
- Nikaum
- Vina

### Library data of the parts
C1 C15 C17 C19 = 885012107015: CAP CER 1uF 25V X5R 0805; Manufacturer: Wurth Electronik; Tolerance: 20%; Library Control - Checked Footprint: Yes; Library Control - Person that Checked Footprint: Nikaum; Supplier 1: Mouser; Part Number: 885012107015; Category: Ceramic Capacitor; Price: 1 = 0,10, 10=0,082, 100=0,073 (USD); Supplier Part Number 1: 710-885012107015; Library Ref: Capacitor; Operating Temperature: -55 C ~ 85 C; Package / Case: 0805 (2012 Metric); Size / Dimension: 2,00 L x 1,25 W x 1,25 H; Value: 1uF; Voltage - Rated: 25V; ESR: -; Dieletric: X5R; Library Control - Checked Schematic: Yes; Library Control - Last Update: 28/06/2021 00:10; Library Control - Person that Checked Schematic: Nikaum; Library Control - Person that did the Last Update Footprint: Nikaum; Library Control - Person that did the Last Update Schematic: Nikaum; ComponentLink1Description: Datasheet; ComponentLink1URL: https://br.mouser.com/datasheet/2/445/885012107015-1727441.pdf; ComponentLink2Description: Mouser Link; ComponentLink2URL: https://br.mouser.com/ProductDetail/Wurth-Elektronik/885012107015?qs=%2Fha2pyFaduggjUC9vDyrNMYsuF9m0S%2FHKLBl4FOBDDHl%252B%252B2XqSGtSQ%3D%3D
C2 C16 C18 C20 = 0805X475M250CT: as C10 on sheet Sensor Infra; Supplier 1: Mouser; Part Number: 0805X475M250CT; Category: Ceramic Capacitor; Price: 1=0,26 10=0,178 100=0,101 1000=0,064 (USD); Supplier Part Number 1: 791-0805X475M250CT; Library Ref: Capacitor; Operating Temperature: -55°C ~ 85°C; Package / Case: 0805(2012 metric); Size / Dimension: 2 mm L x 1.25 mm W x 0.8 mm H; Tolerance: 20%; Value: 4.7uF; Voltage - Rated: 25V; ESR: -; Library Control - Last Update: 26/06/2021 19:59; ComponentLink1Description: Datasheet; ComponentLink1URL: https://br.mouser.com/datasheet/2/210/WTC_MLCC_General_Purpose-1534899.pdf; ComponentLink2Description: Mouser Link; ComponentLink2URL: https://br.mouser.com/ProductDetail/Walsin/0805X475M250CT?qs=%2Fha2pyFadugovbtJ4IPO2aI5%2FHfN6czWOLxzJ368rfolfgZFQZPK8JJR9MicoCMy
C3 = C0805C104K5RACTU: CAP CER 0.1uF 50V X7R 0805; Manufacturer: Kemet; Tolerance: 10%; Voltage - Rated: 50 VDC; Library Control - Checked Footprint: No; Library Control - Checked Schematic: Yes; Library Control - Person that Checked Schematic: Guilherme; Library Control - Person that did the Last Update Schematic: Marcos; Supplier 1: Mouser; Part Number: C0805C104K5RACTU; Category: Ceramic Capacitor; Price: 1=0,24 10=0,126 100=0,076 1000=0,059 (USD); Supplier Part Number 1: 80-C0805C104K5R; Library Ref: Capacitor; Operating Temperature: -55°C ~ 125°C; Package / Case: 0805(2012 metric); Size / Dimension: 2 mm L  x 1.25 mm W  x  0.78 mm H; Value: 0.1 uF; ESR: -; Dieletric: X7R; Library Control - Last Update: 26/06/2021 20:48; ComponentLink1Description: Datasheet; ComponentLink1URL: https://br.mouser.com/datasheet/2/212/KEM_C1002_X7R_SMD-1102033.pdf; ComponentLink2Description: Mouser Link; ComponentLink2URL: https://br.mouser.com/ProductDetail/KEMET/C0805C104K5RACTU?qs=Pc30aiB8zWUISNb2Qeyxfw%3D%3D
D1 D9-D11 = EAST3215BA5: as D4 on sheet Controle; Supplier 1: Mouser; Part Number: EAST3215BA5; Category: Standard LEDs - SMD; Price: 1 = 0,3800, 10 = 0,2050, 100 = 0.1080 (USD); Package / Case: 3215; Color: Blue; Operating Temperature: - 40 °C ~ 85 °C; Luminous Intensity: 45 mcd; Library Ref: Diodo/Led; Supplier Part Number 1: 638-EAST3215BA5; Max Power Dissipation: 75 mW; Max Current Rating: 20 mA; Library Control - Checked Schematic: yes; Library Control - Last Update: 13/06/2021 12:45; Library Control - Person that Checked Schematic: Lucas; Library Control - Person that did the Last Update Schematic: Stéfany (Ster); ComponentLink1Description: Mouser Link; ComponentLink1URL: https://www.mouser.com/ProductDetail/Everlight/EAST3215BA5?qs=Cqqh%252BS766wnzp9nQVj5A4g==; ComponentLink2Description: Datasheet; ComponentLink2URL: https://www.mouser.com/datasheet/2/143/EAST3215BA5-1154292.pdf
D2 = B540C-13-F: DIODE SCHOTTKY 40V 5A DO-214AB; Manufacturer: Diodes Incorporated; Max Forward Surge Current (Ifsm): 100 A; Current - Reverse Leakage @ Vr: 500 uA; Voltage - Forward (Vf) (Max) @ If: 550 mV; Diode Type: Schottky Barrier Rectifier; Library Control - Checked Footprint: yes; Library Control - Person that did the Last Update Footprint: Dalarme; Library Control - Person that did the Last Update Schematic: Stéfany(Ster); Capacitance @ Vr, F: 300 pF @ 4V, 1MHz; Supplier 1: Mouser; Part Number: B540C-13-F; Category: Schottky Diodes & Rectifiers; Price: 1 = 0,53, 10 = 0,454, 100 = 0,339 (USD); Package / Case: SMC (DO-214AB); Current - Average Rectified (Io): 5 A; Operating Temperature: - 55ºC ~ 125ºC; Voltage - DC Reverse (Vr) (Max): 40 V; Library Ref: Diode; Supplier Part Number 1: 621-B540C-F; Library Control - Checked Schematic: yes; Library Control - Last Update: 21/06/2021 13:20; ComponentLink1Description: Mouser Link; ComponentLink1URL: https://www.mouser.com/ProductDetail/Diodes-Incorporated/B540C-13-F?qs=%2Fha2pyFadugB25bXQPJfFXI5hzpNpnVpraRSN9VwgHc%3D; ComponentLink2Description: Datasheet; ComponentLink2URL: https://www.mouser.com/datasheet/2/115/ds13012-73423.pdf
D3 = ESD110B102ELE6327XTMA1: DIODE TVS 26V 14.2A DO-214AA-2; Manufacturer: Infineon; Voltage - Forward (Vf) (Max) @ If: -15 V - +15 V; Library Control - Checked Footprint: No; Library Control - Person that did the Last Update Footprint: Nikaum; Power Dissipation: 58 W; Supplier 1: Mouser; Part Number: ESD110B102ELE6327XTMA1; Category: ESD Suppressors / TVS Diodes; Price: 1 = 0,48, 10 = 0,36, 100 = 0,225 (USD); Package / Case: TSLP-2; Operating Temperature: - 40ºC ~ 125ºC; Diode Type: TVS; Library Ref: Diode; Supplier Part Number 1: 726-ESD110B102ELE632; Library Control - Checked Schematic: No; Library Control - Last Update: 13/06/2021 13:28; Library Control - Person that did the Last Update Schematic: Nikaum; ComponentLink1Description: Datasheet; ComponentLink1URL: https://www.mouser.com/datasheet/2/196/Infineon-ESD110-B1-02series-DS-v01_04-EN-1731333.pdf; ComponentLink2Description: Mouser Link; ComponentLink2URL: https://www.mouser.com/ProductDetail/Infineon-Technologies/ESD110B102ELE6327XTMA1?qs=%2Fha2pyFaduiogV8KDD5PH1He7eBI5EnoxEmNaeUv4GVgUCwgbnNdrWufEfAgVCzv
GND1 = Ground Pad Mini Sumô: GND PAD MINI SUMÔ; Cable AWG: 20 / 18 (AWG); Recomended Category: Mini Sumô; Size: 3.5 x 3.5 (mm); Library Ref: Pads
J14 J15 = Female Header 2: System: Connector
R1 R5 R6 R14 = RC0603FR-07240RL: as R7 on sheet Controle; Supplier 1: Mouser; Part Number: RC0603FR-07240RL; Category: Current Sense Resistors - SMD; Price: 1= 0,10, 10= 0,024, 100= 0,01 (USD); Package / Case: 0603 (1608 metric); Operating Temperature: -55C ~ +155C; Value: 240 Ohms; Tolerance: 1%; Voltage Rating: -; Library Ref: Resistor; Resistor Type: Fixed; Size / Dimension: 1.6mm L x 0.8mm W x 0.45mm H; Supplier Part Number 1: 603-RC0603FR-07240RL; ComponentLink1Description: Mouser Link; ComponentLink1URL: https://br.mouser.com/ProductDetail/YAGEO/RC0603FR-07240RL?qs=%2Fha2pyFaduiUxY9aBc7vYsXmDGghjtsAaASQnplf3Fe6IIYOTbEeqCNZ6k5LKUyr; ComponentLink2Description: Datasheet; ComponentLink2URL: https://br.mouser.com/datasheet/2/447/Yageo_03_18_2021_PYu_RC_Group_51_RoHS_L_11-2199992.pdf
U1-U4 = LDL1117S33R: IC REG LINEAR 3.3V 1.2A SOT-223-4; Manufacturer: STMicroelectronics; Max Power Dissipation: Internally limited; Output Type: Fixed; Number of Regulators: 1; Voltage - Input (Max): 18V; Current - Quiescent (Iq): 250 uA; Voltage - Dropout (Max): 600mV (1.2 A); Library Control - Checked Footprint: Yes; Library Control - Person that Checked Footprint: Nícolas; Library Control - Person that did the Last Update Footprint: Pierre; Voltage - Output (Max): 3.6V; Supplier 1: Mouser; Part Number: LDL1117S33R; Library Ref: Voltage Regulator; Category: Linear Voltage Regulator; Price: 1= 0.46000, 10= 0.34000, 100= 0.22900 (USD); Package/ Case: SOT-223-4; Operating Temperature: -40°C~125°C; Voltage - Output (Min/Fixed): 3.3 V; Supplier Part Number 1: 511-LDL1117S33R; Library Control - Checked Schematic: Yes; Library Control - Last Update: 23/06/21 10:22; Library Control - Person that Checked Schematic: Nícolas; Library Control - Person that did the Last Update Schematic: Nícolas; Current - Output: 1.2 A; Power Dissipation: Internally limited; ComponentLink1Description: Mouser Link; ComponentLink1URL: https://br.mouser.com/ProductDetail/STMicroelectronics/LDL1117S33R?qs=%2Fha2pyFadugA91l4ky%2FRZ5SN3GrMJ6YI2MUHTqmRDLfkBVrFdA%252BW6Q%3D%3D; ComponentLink2Description: Datasheet; ComponentLink2URL: https://br.mouser.com/datasheet/2/389/dm00366442-1799212.pdf
VCC1 = Source Pad Mini Sumô: VCC PAD MINI SUMÔ; Cable AWG: 20 / 18 (AWG); Recomended Category: Mini Sumô; Size: 3.5 x 3.5 (mm); Library Ref: Pads

## Nets that join several sheets
3.3V-ESP: Comunicacao (J13.3V3), Fonte (C16.2 R5.2 U2.2)
3.3V-MICRO-TB66: Controle (J1.PIN1 J3.PIN1 J5.PIN1), Fonte (C20.2 R14.2 U4.2)
3.3V-SENSOR: Controle (8 pins), SensorInfra1 (C10_SensorInfra1.2 C11_SensorInfra1.2 J9_SensorInfra1.PIN1), SensorInfra2 (C10_SensorInfra2.2 C11_SensorInfra2.2 J9_SensorInfra2.PIN1), SensorInfra3 (C10_SensorInfra3.2 C11_SensorInfra3.2 J9_SensorInfra3.PIN1), SensorInfra4 (C10_SensorInfra4.2 C11_SensorInfra4.2 J9_SensorInfra4.PIN1), SensorInfra5 (C10_SensorInfra5.2 C11_SensorInfra5.2 J9_SensorInfra5.PIN1), SensorInfra6 (C10_SensorInfra6.2 C11_SensorInfra6.2 J9_SensorInfra6.PIN1), SensorInfra7 (C10_SensorInfra7.2 C11_SensorInfra7.2 J9_SensorInfra7.PIN1), Fonte (C18.2 R6.2 U3.2)
VDD: Controle (18 pins), Fonte (C2.2 R1.2 U1.2)
VSS: Controle (23 pins), SensorInfra1 (C10_SensorInfra1.1 C11_SensorInfra1.1 J9_SensorInfra1.PIN2), SensorInfra2 (C10_SensorInfra2.1 C11_SensorInfra2.1 J9_SensorInfra2.PIN2), SensorInfra3 (C10_SensorInfra3.1 C11_SensorInfra3.1 J9_SensorInfra3.PIN2), SensorInfra4 (C10_SensorInfra4.1 C11_SensorInfra4.1 J9_SensorInfra4.PIN2), SensorInfra5 (C10_SensorInfra5.1 C11_SensorInfra5.1 J9_SensorInfra5.PIN2), SensorInfra6 (C10_SensorInfra6.1 C11_SensorInfra6.1 J9_SensorInfra6.PIN2), SensorInfra7 (C10_SensorInfra7.1 C11_SensorInfra7.1 J9_SensorInfra7.PIN2), Comunicacao (D8.C J13.GND), Fonte (21 pins)
ESP32: Controle (IC1.30), Comunicacao (J13.PIN2)